# EasyEDA Pro project ProPrj_USB拓展坞_2026-03-28.epro

# Schematic Schematic1
Board Name: Board1; Create Date: 2025-09-25; Page Name: P1; Project Name: USB拓展坞; Schematic Name: Schematic1; Update Date: 2025-09-26; Company: 嘉立创EDA; Page Size: A4; Version: V1.0
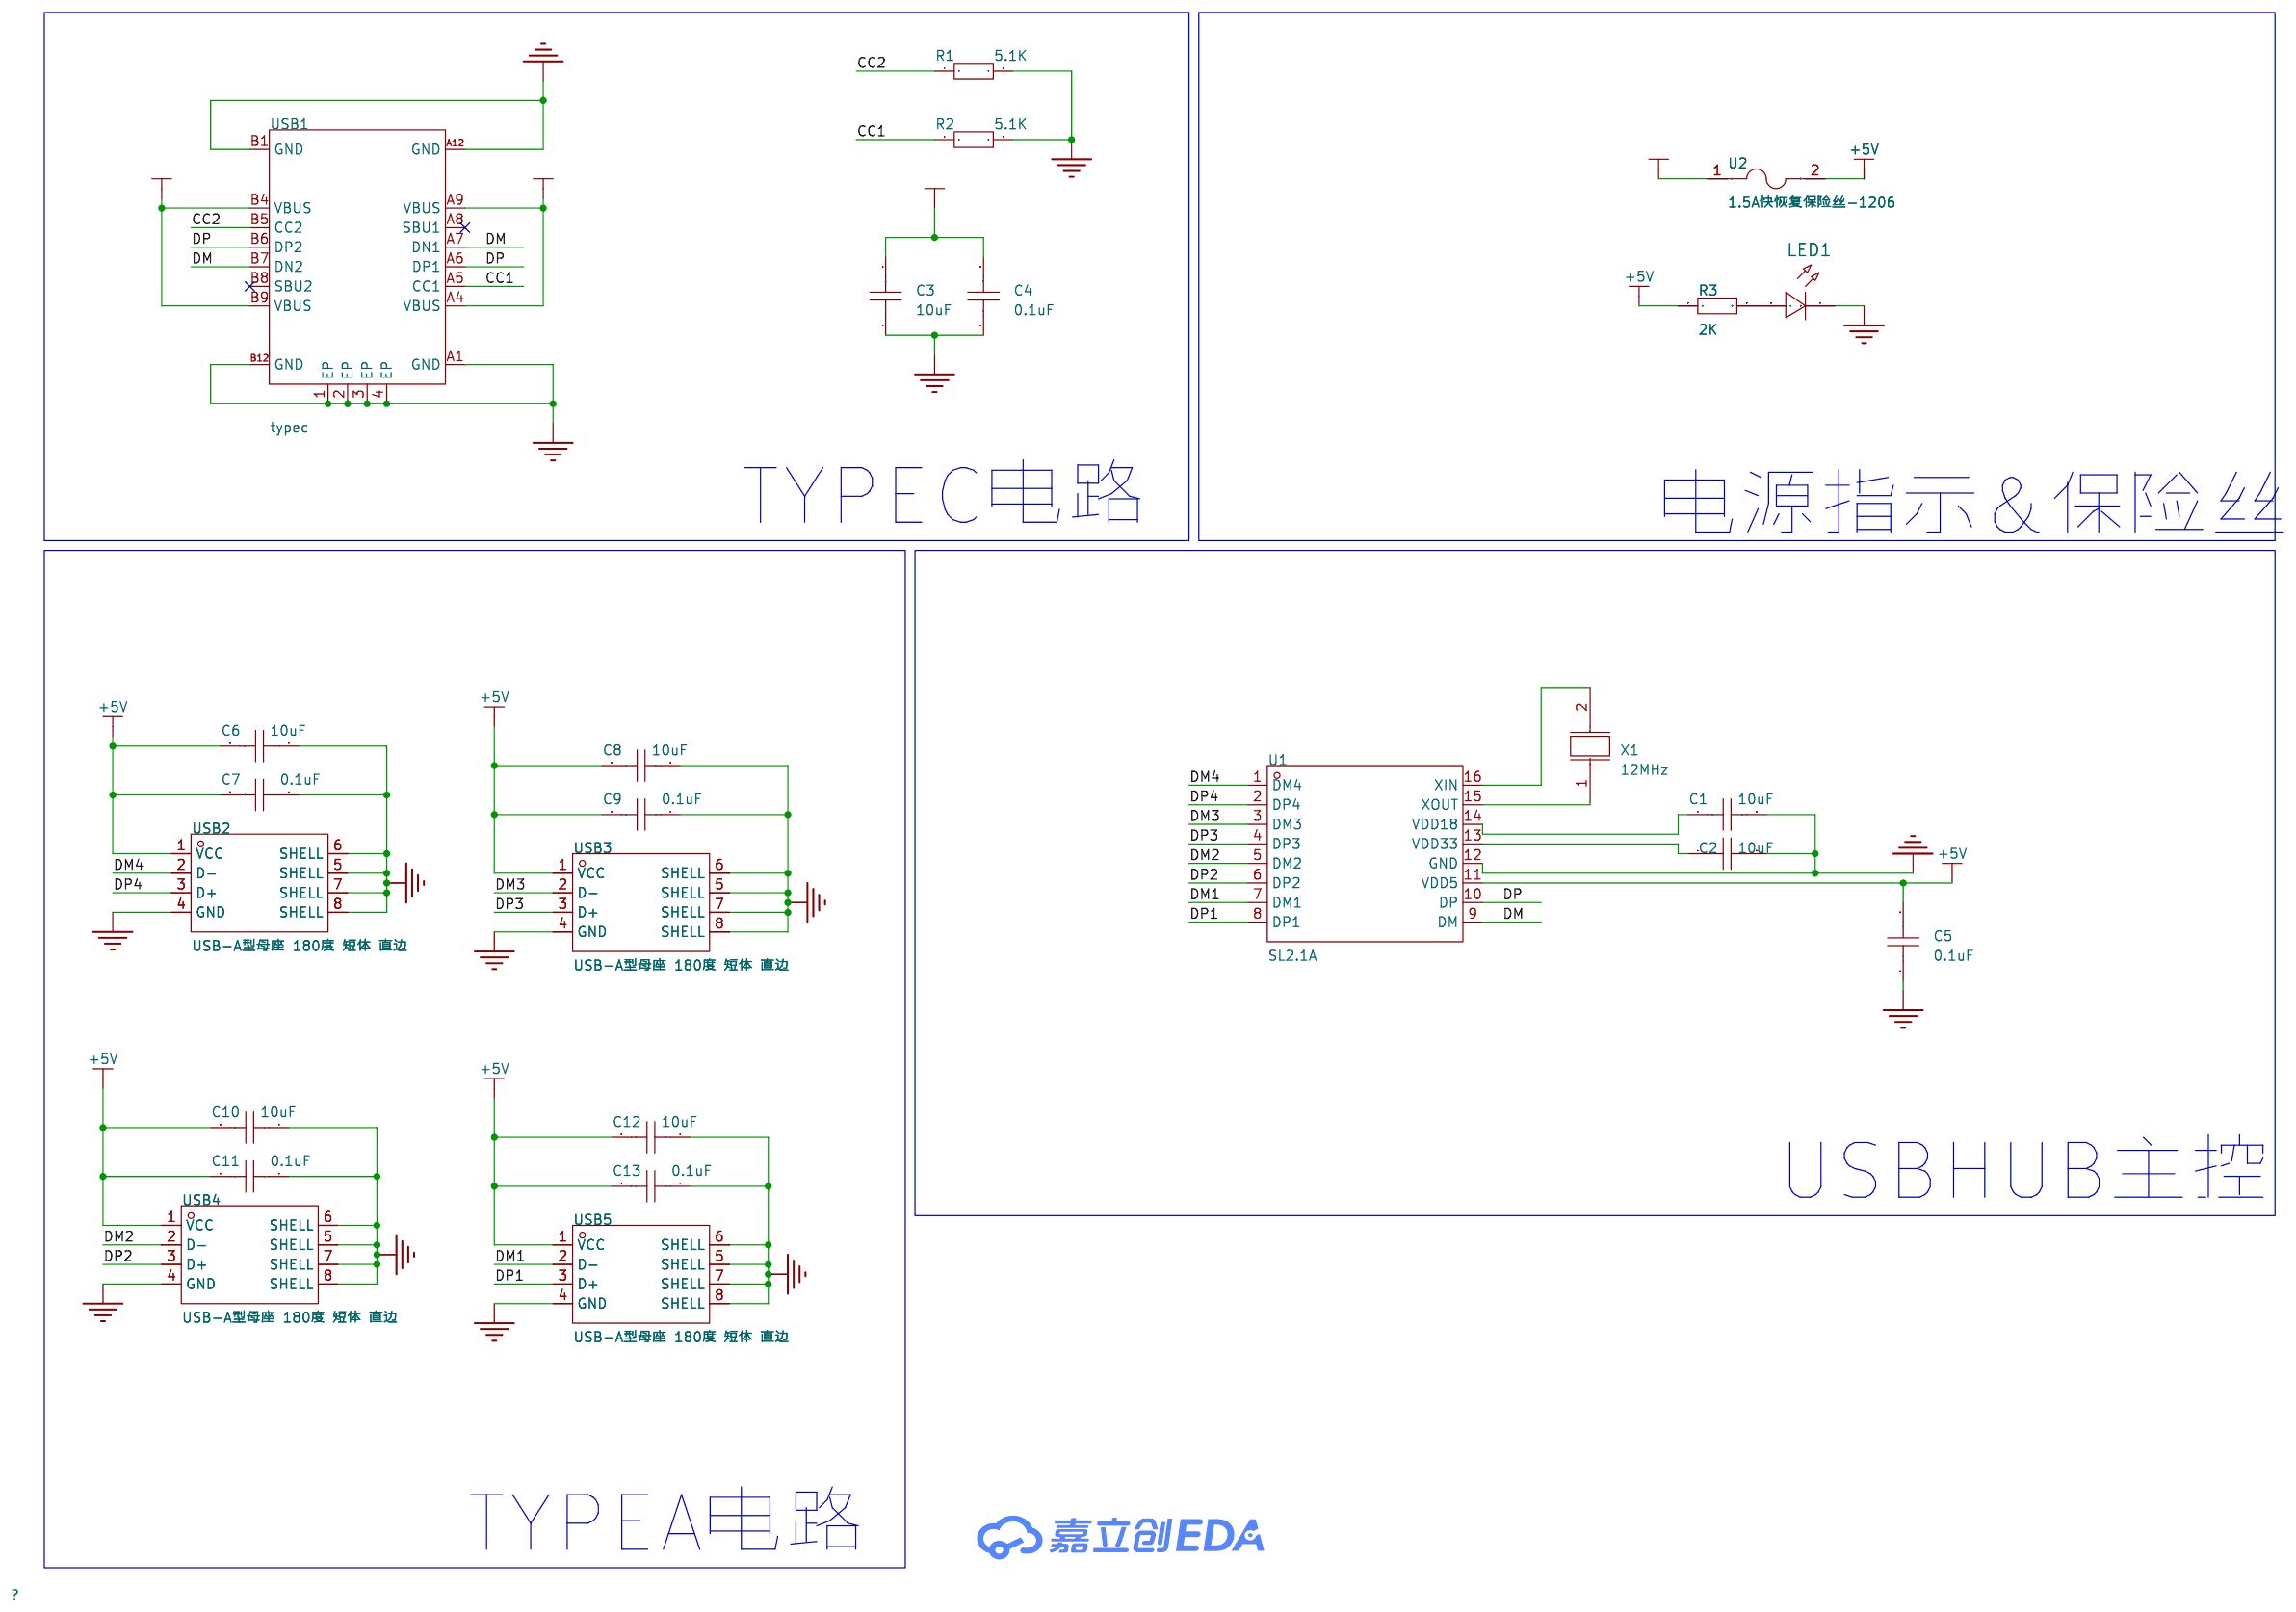
[diagram p0: schematic sheet]

## Parts
C1  10uF  [C0805]
C2  10uF  [C0805]
C3  10uF  [C0805]
C4  0.1uF  [C0805]
C5  0.1uF  [C0805]
C6  10uF  [C0805]
C7  0.1uF  [C0805]
C8  10uF  [C0805]
C9  0.1uF  [C0805]
C10  10uF  [C0805]
C11  0.1uF  [C0805]
C12  10uF  [C0805]
C13  0.1uF  [C0805]
LED1  -  [LED_0805]
R1  5.1K  [R0805]
R2  5.1K  [R0805]
R3  2K  [R0805]
U1  SL2.1A  [SOP-16_L10.0-W3.9-P1.27-LS6.0-BL]
U2  1.5A快恢复保险丝-1206  [F1206]
USB1  typec  [USB-C-SMD_KH-TYPE-C-16P]
USB2  USB-A型母座 180度 短体 直边  [USB-A-SMD_WT_C9900004571]
USB3  USB-A型母座 180度 短体 直边  [USB-A-SMD_WT_C9900004571]
USB4  USB-A型母座 180度 短体 直边  [USB-A-SMD_WT_C9900004571]
USB5  USB-A型母座 180度 短体 直边  [USB-A-SMD_WT_C9900004571]
X1  12MHz  [CRYSTAL-SMD_L5.0-W3.2-1-A]

## Library data of the parts
C1-C13 = CAP_0805: Supplier Footprint: 0805
LED1 = LED_0805-R: Supplier Footprint: 0805
R1-R3 = Res_0805: Supplier Footprint: 0805
U1 = SL2.1A: SL2.1A是一颗高集成度,高性能,低功耗的USB2.0集线器主控芯片，支持USB2.0高速(480MHz),全速(12MHz)和低速模式(1.5MHz)，内置12MHz晶体振荡器。; LCSC Part Name: USB2.0高速4端口HUB控制器; Supplier Part: C192893; Manufacturer: CoreChips(和芯润德); Supplier Footprint: SOP-16; JLCPCB Part Class: 扩展库; Datasheet: https://item.szlcsc.com/datasheet/SL2.1A/225853.html; Supplier: LCSC
U2 = 1.5A快恢复保险丝-1206: Supplier Part: C9900012139; JLCPCB Part Class: 扩展库; Supplier: LCSC
USB1 = typec: Supplier Part: C9900016956; Supplier Footprint: typec 12p; JLCPCB Part Class: 扩展库; Supplier: LCSC
USB2-USB5 = USB-A型母座 180度 短体 直边: Supplier Part: C9900004571; Supplier Footprint: SMD; JLCPCB Part Class: 扩展库; Supplier: LCSC
X1 = 12MHz: Supplier Part: C9900003079; Supplier Footprint: CRYSTAL5032-2P; JLCPCB Part Class: 扩展库; Supplier: LCSC

## Nets
+5V: C5.2 C6.2 C7.2 C8.2 C9.2 C10.2 C11.2 C12.2 C13.2 R3.1 U1.11(VDD5) U2.2 USB2.1(VCC) USB3.1(VCC) USB4.1(VCC) USB5.1(VCC)
GND: C1.2 C2.2 C3.1 C4.1 C5.1 C6.1 C7.1 C8.1 C9.1 C10.1 C11.1 C12.1 C13.1 LED1.1(C) R1.2 R2.2 U1.12(GND) USB1.1(EP) USB1.2(EP) USB1.3(EP) USB1.4(EP) USB1.A1(GND) USB1.A12(GND) USB1.B1(GND) USB1.B12(GND) USB2.4(GND) USB2.5(SHELL) USB2.6(SHELL) USB2.7(SHELL) USB2.8(SHELL) USB3.4(GND) USB3.5(SHELL) USB3.6(SHELL) USB3.7(SHELL) USB3.8(SHELL) USB4.4(GND) USB4.5(SHELL) USB4.6(SHELL) USB4.7(SHELL) USB4.8(SHELL) USB5.4(GND) USB5.5(SHELL) USB5.6(SHELL) USB5.7(SHELL) USB5.8(SHELL)
VCC+5V: C3.2 C4.2 U2.1 USB1.A4(VBUS) USB1.A9(VBUS) USB1.B4(VBUS) USB1.B9(VBUS)
CC1: R2.1 USB1.A5(CC1)
CC2: R1.1 USB1.B5(CC2)
DM: U1.9(DM) USB1.A7(DN1) USB1.B7(DN2)
DM1: U1.7(DM1) USB5.2(D-)
DM2: U1.5(DM2) USB4.2(D-)
DM3: U1.3(DM3) USB3.2(D-)
DM4: U1.1(DM4) USB2.2(D-)
DP: U1.10(DP) USB1.A6(DP1) USB1.B6(DP2)
DP1: U1.8(DP1) USB5.3(D+)
DP2: U1.6(DP2) USB4.3(D+)
DP3: U1.4(DP3) USB3.3(D+)
DP4: U1.2(DP4) USB2.3(D+)
$1N648: U1.16(XIN) X1.2
$1N652: U1.15(XOUT) X1.1
$1N656: C1.1 U1.14(VDD18)
$1N660: C2.1 U1.13(VDD33)
$1N2935: LED1.2(A) R3.2

Not connected (* = marked no-connect by the designer): USB1 A8(SBU1)* B8(SBU2)*

## Notes on the sheet
- TYPEC电路
- 电源指示&保险丝
- USBHUB主控
- TYPEA电路

# Board PCB1
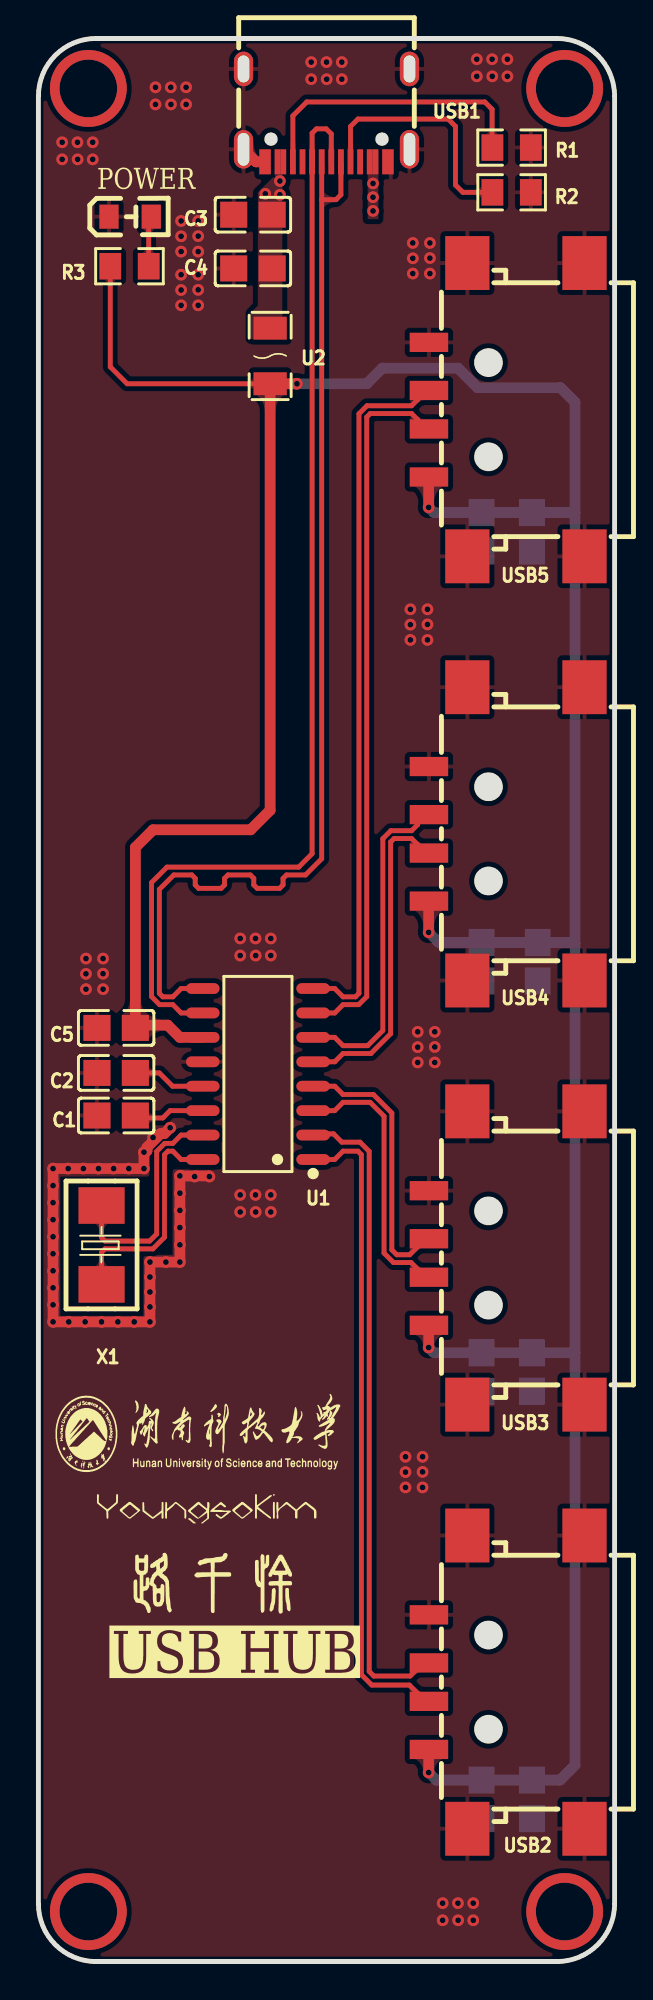
[diagram p1: board, top side]
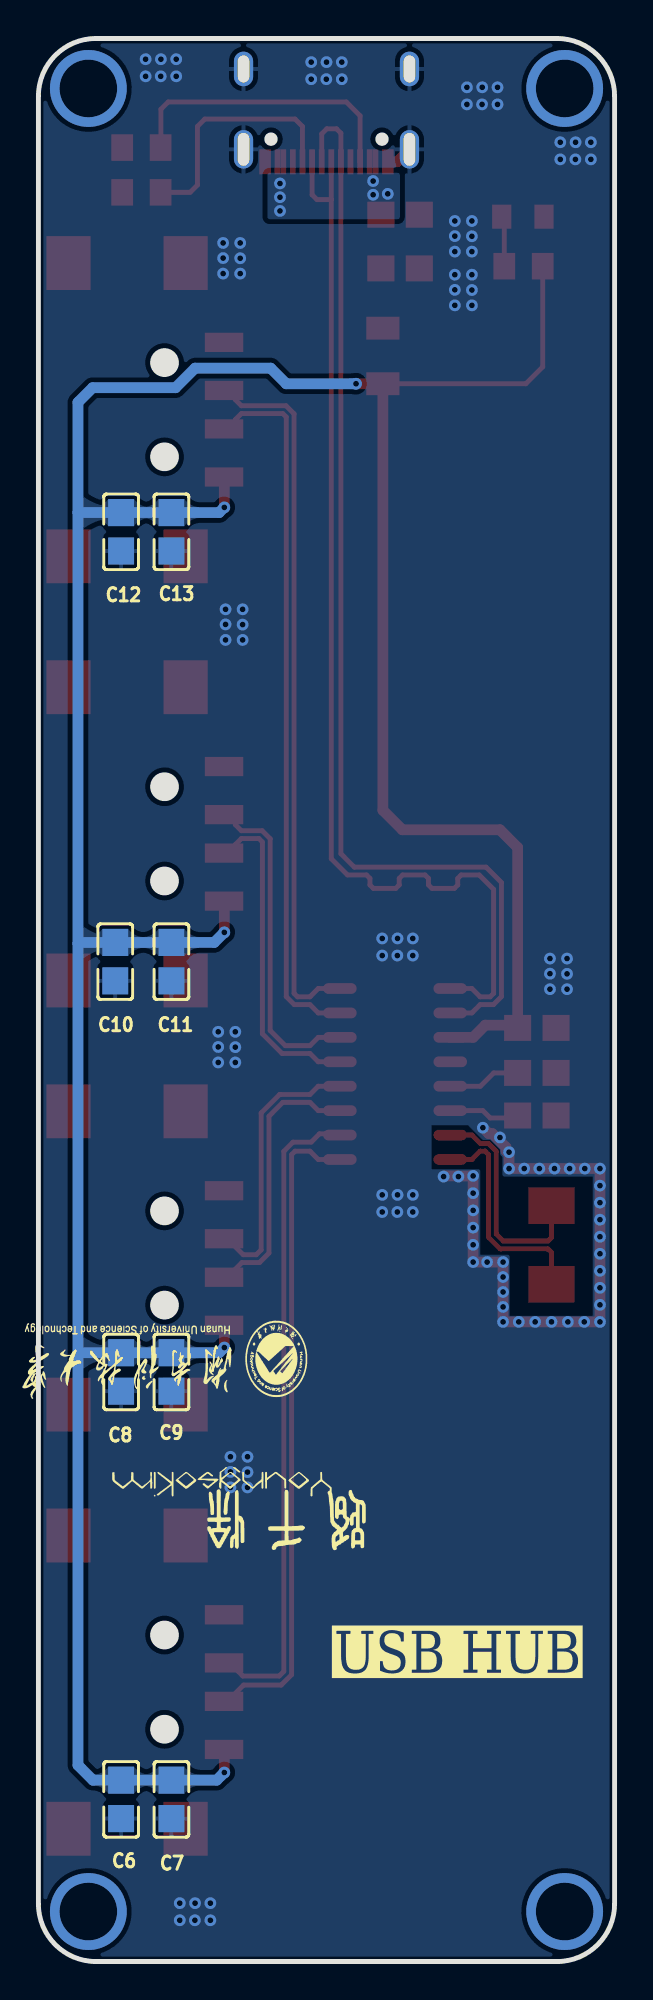
[diagram p2: board, bottom side, seen from below]

Outline 30 x 100 mm; copper layers: Top Layer, Bottom Layer. Coordinates in mm from the lower left corner of the outline.
Outline path: 0,97 0,3 arc(0.88,0.88) 3,0 27,0 arc(29.12,0.88) 30,3 30,97 arc(29.12,99.12) 27,100 3,100 arc(0.88,99.12) 0,97
Stack: Top Layer 0.035mm / Dielectric1 1.51mm FR4 er 4.5 / Bottom Layer 0.035mm

## Design rules (mm)
net DM4: DP4
net DP4: DP4
net DM3: DP3
net DP3: DP3
net DM2: DP2
net DP2: DP2
net DM1: DP1
net DP1: DP1
net $1N648: DP6
net $1N652: DP6
net DP: DP5
net DM: DP5
template: 自定义配置
spacing copperThickness1oz (default): track to track 0.102, other pairs 0.152 to 0.3
spacing copperThickness2oz: track to track 0.203, other pairs 0.152 to 0.3
track width copperThickness1oz (default): min 0.127, default 0.254, max 2.54
track width copperThickness2oz: min 0.203, default 0.254, max 2.54
differential pair differentialPair (default): width min 0.127, default 0.254, max 2.54; gap min 0.152, default 0.152
via viaSize (default): diameter min 0.5, default 0.61, max 10; hole min 0.3, default 0.305, max 6.299

## Placement (name value [footprint] x y rotation side)
C1  10uF  [C0805]  4.05 43.99 180 top
C2  10uF  [C0805]  4.05 46.21 180 top
C3  10uF  [C0805]  11.17 90.84 0 top
C4  0.1uF  [C0805]  11.17 88.04 0 top
C5  0.1uF  [C0805]  4.05 48.55 0 top
C6  10uF  [C0805]  25.69 8.43 90 bottom
C7  0.1uF  [C0805]  23.07 8.43 90 bottom
C8  10uF  [C0805]  25.69 30.66 90 bottom
C9  0.1uF  [C0805]  23.07 30.66 90 bottom
C10  10uF  [C0805]  26 51.99 90 bottom
C11  0.1uF  [C0805]  23.07 51.99 90 bottom
C12  10uF  [C0805]  25.69 74.35 90 bottom
C13  0.1uF  [C0805]  23.07 74.35 90 bottom
LED1  -  [LED_0805]  4.83 90.73 0 top
R1  5.1K  [R0805]  24.64 94.33 0 top
R2  5.1K  [R0805]  24.64 92 0 top
R3  2K  [R0805]  4.74 88.16 0 top
U1  SL2.1A  [SOP-16_L10.0-W3.9-P1.27-LS6.0-BL]  11.43 46.15 90 top
U2  1.5A快恢复保险丝-1206  [F1206]  12.06 83.49 270 top
USB1  typec  [USB-C-SMD_KH-TYPE-C-16P]  15 96 180 top
USB2  USB-A型母座 180度 短体 直边  [USB-A-SMD_WT_C9900004571]  24.38 14.53 90 top
USB3  USB-A型母座 180度 短体 直边  [USB-A-SMD_WT_C9900004571]  24.38 36.58 90 top
USB4  USB-A型母座 180度 短体 直边  [USB-A-SMD_WT_C9900004571]  24.38 58.64 90 top
USB5  USB-A型母座 180度 短体 直边  [USB-A-SMD_WT_C9900004571]  24.38 80.7 90 top
X1  12MHz  [CRYSTAL-SMD_L5.0-W3.2-1-A]  3.29 37.26 270 top

## Footprints (pads in the part's own frame, mm; a bottom-side part is the same pattern mirrored in y, then rotated)
C0805
  rect 1.41x1.35 smd: 1(-1,0) 2(1,0)
CRYSTAL-SMD_L5.0-W3.2-1-A
  rect 1.9x2.4 smd: 1(-2.05,0) 2(2.05,0)
F1206
  rect 1.19x1.728 smd: 1(-1.445,0) 2(1.445,0)
LED_0805
  rect 1x1.25 smd: 1(-1.15,0.005) 2(1.05,0.005)
R0805
  rect 1.133x1.377 smd: 1(-1,0) 2(1,0)
SOP-16_L10.0-W3.9-P1.27-LS6.0-BL
  oval 0.56x1.745 smd: 1(-4.445,-2.873) 2(-3.175,-2.873) 3(-1.905,-2.873) 4(-0.635,-2.873) 5(0.635,-2.873) 6(1.905,-2.873) 7(3.175,-2.873) 8(4.445,-2.873) 9(4.445,2.873) 10(3.175,2.873) 11(1.905,2.873) 12(0.635,2.873) 13(-0.635,2.873) 14(-1.905,2.873) 15(-3.175,2.873) 16(-4.445,2.873)
USB-A-SMD_WT_C9900004571
  rect 1x2 smd: 1(-3.5,4.05) 2(-1,4.05) 3(1,4.05) 4(3.5,4.05)
  rect 2.8x2.3 smd: 5(-7.625,2.05) 6(-7.625,-4.05) 7(7.625,-4.05) 8(7.625,2.05)
USB-C-SMD_KH-TYPE-C-16P
  oval 1x2 hole 0.6x1.7: 1(-4.32,1.765) 2(4.32,1.765)
  oval 1x1.8 hole 0.6x1.4: 3(-4.32,-2.415) 4(4.32,-2.415)
  rect 0.3x1.3 smd: A1(-3.35,2.415) A4(-2.55,2.415) A5(-1.25,2.415) A6(-0.25,2.415) A7(0.25,2.415) A8(1.25,2.415) A9(2.55,2.415) A12(3.35,2.415) B1(3.05,2.415) B4(2.25,2.415) B5(1.75,2.415) B6(0.75,2.415) B7(-0.75,2.415) B8(-1.75,2.415) B9(-2.25,2.415) B12(-3.05,2.415)

## Nets
As in the schematic.

Pads without a net: USB1 A8 B8

## Via types
v1: diameter 4, hole 3, Top Layer to Bottom Layer, 4 vias
v2: diameter 0.61, hole 0.305, Top Layer to Bottom Layer, 133 vias

## Routing (per net, layer and track width the routed paths; a pad name or vN(x,y) marks a point on that pad's centre or on a via; arc(x,y) is an arc through that point)
+5V: length 182
  Top Layer w0.254: R3.1 3.74,82.92 4.62,82.05 U2.2
  Top Layer w0.559: v2(20.32,75.62) 20.32,77.18 USB5.1 ; v2(20.32,9.83) 20.32,11.01 USB2.1 ; USB3.1 20.32,33.07 v2(20.32,31.93) ; U1.11 7.37,48.06 6.73,48.69 5.19,48.69 C5.2 5.05,57.93 5.97,58.85 11.05,58.85 12.06,59.87 U2.2 v2(13.46,82.05) ; USB4.1 20.32,55.13 v2(20.32,53.52)
  Bottom Layer w0.559: v2(20.32,31.93) 20.59,31.66 C9.2 C8.2 27.93,31.66 27.94,31.67 ; 27.94,31.67 27.94,10.21 27.16,9.43 C6.2 C7.2 20.72,9.43 v2(20.32,9.83) ; 27.94,31.67 27.94,52.95 ; 27.94,75.35 27.94,81.08 27.18,81.84 22.86,81.84 21.84,82.86 17.91,82.86 17.1,82.05 v2(13.46,82.05) ; 27.94,75.35 C12.2 C13.2 20.59,75.35 v2(20.32,75.62) ; 27.94,75.35 27.94,52.95 ; 27.94,52.95 27.89,52.99 C10.2 C11.2 20.84,52.99 v2(20.32,53.52)
GND: length 32.5
  Top Layer w0.559: USB1.A12 11.33,93.58 USB1.2 ; v2(6.86,43.36) 6.55,43.05 6.37,43.05 5.65,42.34 5.65,42.15 5.5,42 v2(5.5,41.23) v2(4.71,41.23) v2(3.92,41.23) v2(3.13,41.23) v2(2.34,41.23) v2(1.55,41.23) v2(0.76,41.23) v2(0.76,40.35) v2(0.76,39.46) v2(0.76,38.58) v2(0.76,37.69) v2(0.76,36.8) v2(0.76,35.92) v2(0.76,35.03) v2(0.76,34.15) v2(0.76,33.26) v2(1.58,33.26) v2(2.43,33.26) v2(3.28,33.26) v2(4.14,33.26) v2(4.99,33.26) v2(5.81,33.26) v2(5.81,34.04) v2(5.81,34.82) v2(5.81,35.59) v2(5.81,36.37) v2(6.64,36.37) v2(7.37,36.37) v2(7.37,37.27) v2(7.37,38.17) v2(7.37,39.06) v2(7.37,39.96) v2(7.37,40.85) 7.49,40.85 7.5,40.85 8.21,40.85 8.21,40.85 8.87,40.85 v2(8.9,40.82)
  vias: v2(1.24,94.6) v2(1.24,93.71) v2(2.03,94.6) v2(2.04,93.71) v2(2.48,52.16) v2(2.48,51.36) v2(2.48,50.56) v2(2.83,94.6) v2(2.83,93.71) v2(3.37,52.16) v2(3.37,51.37) v2(3.37,50.56) v2(5.5,42.09) v2(5.97,42.85) v2(6.1,97.46) v2(6.1,96.57) v2(6.89,97.46) v2(6.9,96.57) v2(7.43,90.51) v2(7.43,89.71) v2(7.43,88.92) v2(7.43,87.72) v2(7.43,86.92) v2(7.43,86.12) v2(7.69,97.46) v2(7.69,96.57) v2(8.13,40.82) v2(8.32,90.51) v2(8.32,89.72) v2(8.32,88.92) v2(8.32,87.72) v2(8.32,86.93) v2(8.32,86.12) v2(10.51,53.2) v2(10.51,52.31) v2(10.51,39.87) v2(10.51,38.98) v2(11.3,53.2) v2(11.31,52.31) v2(11.3,39.87) v2(11.31,38.98) v2(12.1,53.2) v2(12.1,52.31) v2(12.1,39.87) v2(12.1,38.98) v2(14.2,98.77) v2(14.2,97.88) v2(15,98.77) v2(15.01,97.88) v2(15.8,98.77) v2(15.8,97.88) v2(19.11,26.25) v2(19.11,25.45) v2(19.11,24.65) v2(19.37,70.32) v2(19.37,69.52) v2(19.37,68.72) v2(19.49,89.37) v2(19.49,88.57) v2(19.49,87.77) v2(19.75,48.35) v2(19.75,47.55) v2(19.75,46.75) v2(20,26.25) v2(20,25.46) v2(20,24.65) v2(20.26,70.32) v2(20.26,69.53) v2(20.26,68.72) v2(20.38,89.37) v2(20.38,88.58) v2(20.38,87.77) v2(20.64,48.35) v2(20.64,47.56) v2(20.64,46.75) v2(21.05,3.04) v2(21.05,2.15) v2(21.84,3.04) v2(21.85,2.15) v2(22.64,3.04) v2(22.64,2.15) v2(22.83,98.92) v2(22.83,98.03) v2(23.62,98.92) v2(23.63,98.03) v2(24.42,98.92) v2(24.42,98.03)
VCC+5V:
  vias: v2(11.81,91.92) v2(12.57,92.59) v2(12.57,91.87) v2(17.42,92.46) v2(17.42,91.75) v2(17.42,91.03)
(no net):
  vias: v1(2.6,97.4) v1(2.6,2.6) v1(27.4,97.4) v1(27.4,2.6)
CC1: length 12.7
  Top Layer w0.254: R2.1 22.1,92 21.72,92.38 21.72,95.43 21.34,95.81 16.64,95.81 16.25,95.42 USB1.A5
CC2: length 15.2
  Top Layer w0.254: USB1.B5 13.25,95.98 13.97,96.7 23.24,96.7 23.62,96.32 23.62,94.34 R1.1
DM: length 58
  Top Layer w0.254: USB1.B7 15.75,91.87 15.49,91.62 14.76,91.62 14.75,91.63 ; 14.75,91.63 USB1.A7 ; 14.75,91.63 14.75,57.35 13.91,56.5 12.92,56.5 12.74,56.32 12.74,55.98 12.56,55.8 11.39,55.8 11.21,55.98 11.21,56.32 11.03,56.5 9.87,56.5 9.69,56.32 9.69,55.98 9.51,55.8 8.34,55.8 8.17,55.98 8.17,56.32 7.99,56.5 7.05,56.5 6.3,55.75 6.3,50.34 6.48,50.17 7,50.17 7.43,50.6 8.56,50.6
DM1: length 37
  Top Layer w0.254: USB5.2 20.17,79.7 19.75,80.11 19.75,80.18 19.43,80.49 17.28,80.49 17.1,80.31 17.1,50.18 16.68,49.76 15.86,49.76 15.43,49.33 U1.7
DM2: length 17
  Top Layer w0.254: U1.5 15.43,46.79 15.86,47.22 17.31,47.22 18.34,48.24 18.34,58.22 18.52,58.4 19.43,58.4 19.75,58.08 19.75,58.06 20.17,57.64 USB4.2
DM3: length 14.1
  Top Layer w0.254: U1.3 15.43,44.25 15.86,44.68 17.27,44.68 18,43.95 18,36.84 18.49,36.35 19.4,36.35 20.17,35.58 USB3.2
DM4: length 33.9
  Top Layer w0.254: USB2.2 20.17,13.53 19.32,14.38 17.36,14.38 16.82,14.92 16.82,41.96 16.64,42.14 15.86,42.14 15.43,41.71 U1.1
DP: length 58.1
  Top Layer w0.254: USB1.A6 15.25,95.04 14.99,95.3 14.48,95.3 14.25,95.07 USB1.B6 14.25,57.61 13.55,56.91 6.69,56.91 5.89,56.11 5.89,50.18 6.31,49.76 7,49.76 7.43,49.33 U1.10
DP1: length 37
  Top Layer w0.254: 14.3,50.6 15.43,50.6 15.86,50.17 16.51,50.17 16.69,50.34 16.69,80.48 17.11,80.9 19.43,80.9 19.75,81.22 19.75,81.28 20.17,81.7 USB5.3
DP2: length 17.1
  Top Layer w0.254: U1.6 15.43,48.06 15.86,47.62 17.15,47.62 17.93,48.41 17.93,58.39 18.35,58.8 19.43,58.8 19.75,59.12 19.75,59.22 20.17,59.64 USB4.3
DP3: length 14.2
  Top Layer w0.254: USB3.3 20.17,37.58 19.34,36.75 18.66,36.75 18.4,37.01 18.4,44.12 17.44,45.08 15.86,45.08 15.43,45.52 U1.4
DP4: length 33.9
  Top Layer w0.254: USB2.3 20.27,15.59 20.1,15.59 19.36,14.85 17.46,14.85 17.22,15.09 17.22,42.13 16.74,42.61 15.8,42.61 15.37,43.04 14.37,43.04 U1.2
$1N648: length 11.8
  Top Layer w0.254: U1.16 7.43,41.71 7,42.14 6.75,42.14 6.57,41.96 6.57,37.67 5.96,37.06 3.47,37.06 3.29,36.88 X1.2
$1N652: length 11.8
  Top Layer w0.254: U1.15 7.43,42.98 7,42.55 6.58,42.55 6.16,42.13 6.16,37.83 5.79,37.47 3.47,37.47 3.29,37.64 X1.1
$1N656: length 3.7
  Top Layer w0.254: C1.1 5.18,43.87 6.48,43.87 6.86,44.25 U1.14
$1N660: length 3.8
  Top Layer w0.254: C2.1 6.29,46.21 6.99,45.52 U1.13
$1N2935: length 2.6
  Top Layer w0.254: LED1.2 5.74,90.6 R3.2

## Copper pours and planes (outline as drawn; the poured copper is in the pictures)
GND on Top Layer: -4.32,102.29 35.81,102.29 35.81,-2.11 -4.32,-2.11
GND on Bottom Layer: -4.06,101.4 33.4,101.4 33.4,-1.73 -4.06,-1.73
VCC+5V on Top Layer: 17.15,94.06 17.7,94.06 17.7,90.6 17.15,90.6
VCC+5V on Top Layer: 11.05,94.11 12.7,94.11 12.7,84.38 11.05,84.38
VCC+5V on Bottom Layer: 11.18,93.02 18.07,93.02 18.07,90.6 11.18,90.6

Small or netless copper shapes (teardrops, artwork), in the pictures only: 118 on Top Layer, 22 on Bottom Layer

## Text on the board
Bottom Silkscreen Layer: USB HUB
Top Silkscreen Layer: POWER | USB HUB
